# Altium project MSE-Interface-N1.PrjPcb (part 2 of 2)

## Sheet MicroSEQSheet.SchDoc
size A4; SheetNumber: 3; SheetTotal: 6
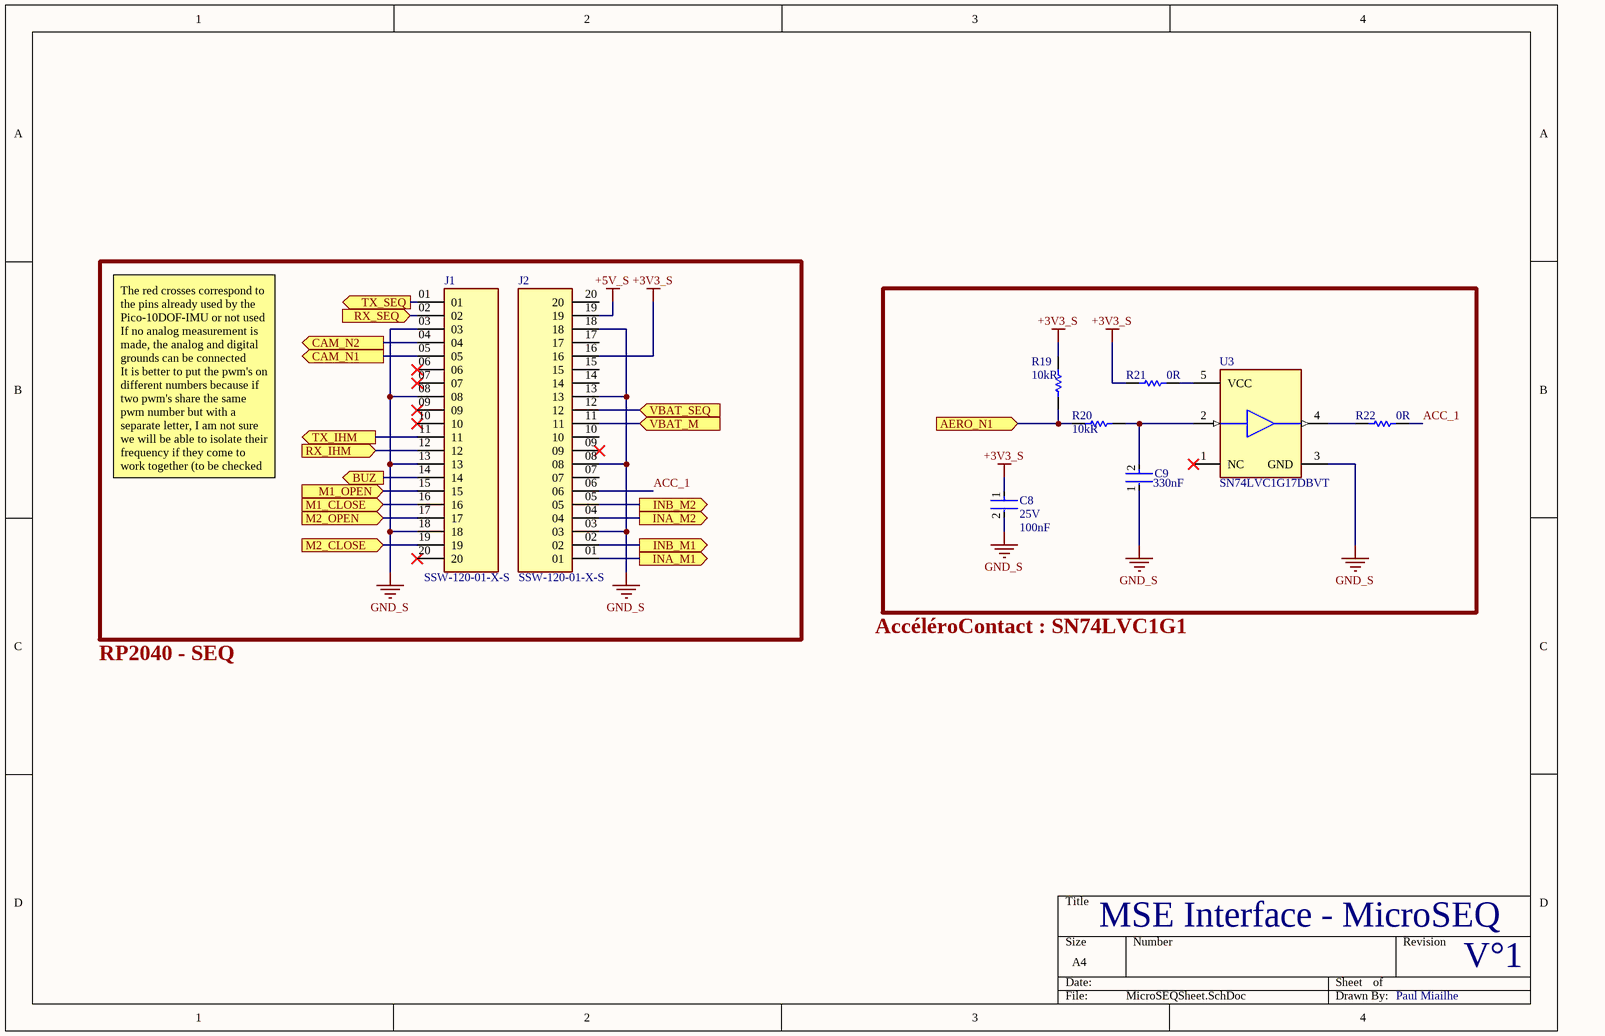
[diagram p4: MicroSEQSheet.SchDoc]

### Parts
C8  Voltage Rating (DC): 25V  Capacitance: 100nF  [FP-CGA3E-0_3-0_1-MFG]  (hidden comment: CGA3E2X7R1E104K080AA)
C9  Capacitance: 330nF  [FP-C1608-080-0_1-IPC_B]  (hidden comment: C1608X7R1H334K080AC)
J1  SSW-120-01-X-S  [SAMTEC_SSW-120-01-X-S]
J2  SSW-120-01-X-S  [SAMTEC_SSW-120-01-X-S]
R19  Resistance: 10kR  [RESC1609X55X30LL15T15]  (hidden comment: ERJ3EKF1002V)
R20  Resistance: 10kR  [RESC1609X55X30LL15T15]  (hidden comment: ERJ3EKF1002V)
R21  0R  [RESC1608X55X25ML10T15]
R22  0R  [RESC1608X55X25ML10T15]
U3  SN74LVC1G17DBVT  [FP-DBV0005A-MFG]

### Ports
AERO_N1 (in, see MainSheet[2B], GPIOSheet[4A]), BUZ (out, see MainSheet[2C], GPIOSheet[2B]), CAM_N1 (out, see MainSheet[2B], GPIOSheet[4A]), CAM_N2 (out, see MainSheet[2B], GPIOSheet[4A]), INA_M1 (out, see MainSheet[2C], GPIOSheet[2A]), INA_M2 (out, see MainSheet[2C], GPIOSheet[2B]), INB_M1 (out, see MainSheet[2C], GPIOSheet[2A]), INB_M2 (out, see MainSheet[2C], GPIOSheet[2B]), M1_CLOSE (in, see MainSheet[2C]), M1_OPEN (in, see MainSheet[2C]), M2_CLOSE (in, see MainSheet[2C]), M2_OPEN (in, see MainSheet[2C]), RX_IHM (in, see MainSheet[2B], GPIOSheet[4C]), RX_SEQ (in, see MainSheet[2C], IsolationSheet[3B]), TX_IHM (out, see MainSheet[2B], GPIOSheet[4C]), TX_SEQ (out, see MainSheet[2C], IsolationSheet[3B]), VBAT_M (in, see MainSheet[2B], PowerSheet[4B]), VBAT_SEQ (in, see MainSheet[2B], PowerSheet[2B])

### Nets
+3V3_S: C8.1 J2.16 R19.2 R21.1
+5V_S: J2.19
GND_S: C8.2 C9.1 J1.03 J1.08 J1.13 J1.18 J2.03 J2.08 J2.13 J2.18 U3.3(GND)
ACC_1: J2.06 R22.2
NetC1_2: J2.12 ; port VBAT_SEQ
NetC7_2: J2.11 ; port VBAT_M
NetC9_2: C9.2 R20.1 U3.2(A)
NetJ1_01: J1.01 ; port TX_SEQ
NetJ1_02: J1.02 ; port RX_SEQ
NetJ1_04: J1.04 ; port CAM_N2
NetJ1_05: J1.05 ; port CAM_N1
NetJ1_11: J1.11 ; port TX_IHM
NetJ1_12: J1.12 ; port RX_IHM
NetJ1_14: J1.14 ; port BUZ
NetJ1_15: J1.15 ; port M1_OPEN
NetJ1_16: J1.16 ; port M1_CLOSE
NetJ1_17: J1.17 ; port M2_OPEN
NetJ1_19: J1.19 ; port M2_CLOSE
NetJ2_01: J2.01 ; port INA_M1
NetJ2_02: J2.02 ; port INB_M1
NetJ2_04: J2.04 ; port INA_M2
NetJ2_05: J2.05 ; port INB_M2
NetR19_1: R19.1 R20.2 ; port AERO_N1
NetR21_2: R21.2 U3.5(VCC)
NetR22_1: R22.1 U3.4(Y)

Not connected (* = marked no-connect by the designer): J1 06* 07* 09* 10* 20*; J2 07 09* 10 14 15 17 20; U3 1(NC)*

### Notes on the sheet
- The red crosses correspond to the pins already used by the Pico-10DOF-IMU or not used
  If no analog measurement is made, the analog and digital grounds can be connected
  It is better to put the pwm's on different numbers because if two pwm's share the same pwm number but with a separate letter, I am not sure we will be able to isolate their frequency if they come to work together (to be checked by software)
- RP2040 - SEQ
- AccéléroContact : SN74LVC1G1
- MSE Interface - MicroSEQ
- V°1
- Paul Miailhe

### Library data of the parts
C8 = CMP-08246-002186-1: Cap Ceramic 100nF 25V X7R 10% Pad SMD 0603 +125°C Automotive T/R; Manufacturer: TDK; Composition: Ceramic; Dielectric: X7R; Ratings: AEC-Q200; Length: 1.6mm; REACH SVHC: No SVHC; Width: 0.031inch; Packaging: Tape and Reel; Case/Package: 0603; Height: 0.8mm; Termination: SMD/SMT; Max Operating Temperature: 125°C; Thickness: 0.035inch; Case Code (Metric): 1608; Lead Free: Lead Free; Mount: Surface Mount; Voltage Rating: 25V; Tolerance: 10%; Weight: 7.1E-05oz; Min Operating Temperature: -55°C; Package Quantity: 1; Depth: 0.8mm; Case Code (Imperial): 0603; Supplier 1: Mouser; Supplier Part Number 1: 810-CGA3E2X7R1E104K; Manufacturer Part Number: CGA3E2X7R1E104K080AA; RoHS: Yes; Category: Ceramic Capacitors; Stock 1: 488891; Pricing 1: 1=0,12000, 10=0,05600, 50=0,05600, 100=0,02500, 1000=0,01400, 10000=0,01000 (USD); Series: CGA; Resistor Type: Ceramic; RoHS Compliant: Yes; ComponentLink1URL: https://datasheet.ciiva.com/24220/cga3e2x7r1e104k080aa-265934-24220022.pdf?src-supplier=Mouser; ComponentLink1Description: https://datasheet.ciiva.com/24220/cga3e2x7r1e104k080aa-265934-24220022.pdf?src-supplier=Mouser; ComponentLink2URL: https://datasheet.ciiva.com/22725/1735392-22725638.pdf?src-supplier=Element14; ComponentLink2Description: https://datasheet.ciiva.com/22725/1735392-22725638.pdf?src-supplier=Element14; ComponentLink3URL: https://datasheet.ciiva.com/22725/1735392-22725639.pdf?src-supplier=Element14; ComponentLink3Description: https://datasheet.ciiva.com/22725/1735392-22725639.pdf?src-supplier=Element14; ComponentLink4URL: https://datasheet.ciiva.com/16427/mlccspec-automotive-general-midvoltage-en-16427320.pdf?src-supplier=Future+Electronics; ComponentLink4Description: https://datasheet.ciiva.com/16427/mlccspec-automotive-general-midvoltage-en-16427320.pdf?src-supplier=Future+Electronics; ComponentLink5URL: https://datasheet.ciiva.com/23803/1735392-23803082.pdf?src-supplier=Newark; ComponentLink5Description: https://datasheet.ciiva.com/23803/1735392-23803082.pdf?src-supplier=Newark
C9 = CMP-2000-07551-2: Multilayer Ceramic Capacitors 330nF ±10% 50V X7R SMD 0603; Case Code (Imperial): 0603; Case Code (Metric): 1608; Dielectric: X7R; Length: 1.6mm; Construction: Flat; Resistor Type: Ceramic; Mount: Surface Mount; Voltage Rating: 50V; Packaging: Tape and Reel; Series: C; Case/Package: 0603; Lead Free: Lead Free; Tolerance: 10%; Voltage: 50V; REACH SVHC: No SVHC; Height: 0.8mm; Weight: 7.1E-05oz; Termination: SMD/SMT; Max Operating Temperature: 125°C; RoHS Compliant: Yes; Min Operating Temperature: -55°C; Depth: 0.8mm; Package Quantity: 1; Thickness: 0.037inch; Voltage Rating (DC): 50V; Dielectric Material: Ceramic; Width: 0.031inch
J1 J2 = CMP-011-000000-2: SSW - Samtec 2.54mm Single Row Straight Socket Strip 8.5 Profile - Fast Stock; MP: SSW-120-01-G-S; Value: *; Check_prices: https://www.snapeda.com/parts/SSW-120-01-G-S/Samtec/view-part/598388/?ref=eda; Price: None; Design Item ID: SSW-120-01-X-S; SnapEDA_Link: https://www.snapeda.com/parts/SSW-120-01-G-S/Samtec/view-part/598388/?ref=snap; Component Type: Standard; MF: Samtec; Source: SSW-120-01-X-S.SchLib; Package: None; Pin Count: 20; Availability: Bad; Purchase-URL: https://pricing.snapeda.com/search/part/SSW-120-01-G-S/?ref=eda
R19 R20 = CMP-1012-00623-3: Chip Resistor, 10 KOhm, +/- 1%, 0.1 W, -55 to 155 degC, 0603 (1608 Metric), RoHS, Tape and Reel; Manufacturer: Panasonic; Manufacturer Part Number: ERJ-3EKF1002V; Voltage Rating: 75V; Case\/Package: 0603; Power Rating: 100mW; Temperature Coefficient: 100ppm\/degreesC; Number of Pins: 2; Package Reference: 603; Depth: 0.8mm; Mount: SurfaceMount; Package Description: 2-Pin Surface Mount Device, Body 1.6 x 0.85 mm; Datasheet Version: 02/2017; Length: 1.6mm; Lead Free: LeadFree; Height: 0.45mm; Number of Terminations: 2; Max Power Dissipation: 100mW; Min Operating Temperature: -55degC; Datasheet URL: https://industrial.panasonic.com/cdbs/www-data/pdf/RDA0000/AOA0000C304.pdf; Termination: SMD/SMT; Case Code (Metric): 1608; Tolerance: 1%; Max Operating Temperature: 155degC; RoHSCompliant: true; Voltage Rating (DC): 75V; Radiation Hardening: No; Packaging: TapeandReel; Composition: ThickFilm; Mounting Technology: SurfaceMount; Manufacturer URL: http://www.panasonic.com/; Width: 0.031inch; REACH SVHC: NoSVHC; Contact Plating: Tin; Military Standard: Not; Package Quantity: 1; Supplier 1: Mouser; Supplier Part Number 1: 667-ERJ-3EKF1002V; RoHS: Yes; Category: Chip SMD Resistors; Stock 1: 20455; Pricing 1: 1=0,10000, 10=0,04000, 50=0,04000, 100=0,01700, 1000=0,00700, 5000=0,00500, 10000=0,00500 (USD); Case/Package: 0603; Size Code: 0603; Resistor Type: Thick Film; Series: ERJ; Resistance Tolerance: 1%; Construction: Rectangular; Features: Automotive AEC-Q200; Technology: THICK FILM; RoHS Compliant: Yes; ComponentLink1URL: https://datasheet.ciiva.com/16511/aoa0000ce2-16511861.pdf?src-supplier=Avnet+Asia; ComponentLink1Description: https://datasheet.ciiva.com/16511/aoa0000ce2-16511861.pdf?src-supplier=Avnet+Asia; ComponentLink2URL: https://datasheet.ciiva.com/46372/1678782-46372725.pdf?src-supplier=Element14; ComponentLink2Description: https://datasheet.ciiva.com/46372/1678782-46372725.pdf?src-supplier=Element14; ComponentLink3URL: https://datasheet.ciiva.com/28514/426256-28514198.pdf?src-supplier=Element14; ComponentLink3Description: https://datasheet.ciiva.com/28514/426256-28514198.pdf?src-supplier=Element14; ComponentLink4URL: https://datasheet.ciiva.com/9194/aoa0000ce2-9194199.pdf?src-supplier=Avnet; ComponentLink4Description: https://datasheet.ciiva.com/9194/aoa0000ce2-9194199.pdf?src-supplier=Avnet; ComponentLink5URL: https://datasheet.ciiva.com/7830/aoa0000ce2-7830729.pdf?src-supplier=Element14; ComponentLink5Description: https://datasheet.ciiva.com/7830/aoa0000ce2-7830729.pdf?src-supplier=Element14; ComponentLink6URL: https://datasheet.ciiva.com/17212/aoa0000ce2-17212105.pdf?src-supplier=Avnet+Europe; ComponentLink6Description: https://datasheet.ciiva.com/17212/aoa0000ce2-17212105.pdf?src-supplier=Avnet+Europe; ComponentLink7URL: https://datasheet.ciiva.com/30208/aoa0000ce2-30208985.pdf?src-supplier=Onlinecomponents.com; ComponentLink7Description: https://datasheet.ciiva.com/30208/aoa0000ce2-30208985.pdf?src-supplier=Onlinecomponents.com; ComponentLink8URL: https://datasheet.ciiva.com/48530/aoa0000ce2-48530988.pdf?src-supplier=Avnet; ComponentLink8Description: https://datasheet.ciiva.com/48530/aoa0000ce2-48530988.pdf?src-supplier=Avnet; ComponentLink9URL: https://datasheet.ciiva.com/24070/aoa0000ce2-24070318.pdf?src-supplier=Mouser; ComponentLink9Description: https://datasheet.ciiva.com/24070/aoa0000ce2-24070318.pdf?src-supplier=Mouser; ComponentLink10URL: https://datasheet.ciiva.com/16759/70260748-16759807.pdf?src-supplier=Allied+Electronics; ComponentLink10Description: https://datasheet.ciiva.com/16759/70260748-16759807.pdf?src-supplier=Allied+Electronics
R21 R22 = CMP-2100-03667-1: Chip Resistor, 0 Ohm, +/- 5%, 0.1 W, -55 to 155 degC, 0603 (1608 Metric), RoHS, Tape and Reel; Manufacturer: Yageo; Temperature Coefficient: 200ppm/degreesC; Voltage Rating: 50V; Power Rating: 100mW; Resistance: 0mOhm; Width: 0.8mm; Max Operating Temperature: 155degC; Tolerance: 5%; Package Reference: 0603; Height: 0.45mm; Depth: 0.8mm; Package Description: 2-Pin Surface Mount Device, Body 1.6 x 0.8 mm; Termination: SMD/SMT; Package Quantity: 5000; Case/Package: 0603; Case Code (Imperial): 0603; Radiation Hardening: No; Number of Pins: 2; Length: 1.6mm; Lead Free: LeadFree; Voltage Rating (DC): 50V; Military Standard: Not; Datasheet URL: http://www.yageo.com/NewPortal/yageodocoutput?fileName=/pdf/R-Chip/PYu-RC_Group_51_RoHS_L_5.pdf; Manufacturer URL: http://www.yageo.com/; Packaging: TapeandReel; Case Code (Metric): 1608; Min Operating Temperature: -55degC; Composition: ThickFilm; RoHSCompliant: true; Contact Plating: Tin; Datasheet Version: Rev. 5, 10/2016; REACH SVHC: NoSVHC
U3 = CMP-0859-00041-5: IC BUF NON-INVERT 5.5V SOT23-5; Manufacturer: Texas Instruments; Number Of Circuits: 1; Logic Function Desc: Non-Inverting; Standoff Height: 0mm; Propagation Delay: 4.6ns; Min Supply Voltage: 1.65V; Nominal Supply Current: 10uA; Category: IC; Height: 1.45mm; Manufacturer Part Number: SN74LVC1G17DBVT; Temperature Range High: +125°C; Device Class L2: Logic ICs; Temperature: -40°C to +125°C; Temperature Range Low: -40°C; Device Class L3: Buffers; Package: DBV0005A; Max Supply Voltage: 5.5V; Ambient Temperature Range High: +125°C; Number Of Outputs: 1; Device Class L1: Integrated Circuits (ICs); ComponentLink2URL: http://www.ti.com/lit/ds/symlink/sn74lvc1g17.pdf; Octopart: https://octopart.com/sn74lvc1g17dbvt-texas+instruments-2326350; Number Of Inputs: 1; Ambient Temperature Range Low: -40°C; ComponentLink2Description: Datasheet; Digikey Description: IC BUF NON-INVERT 5.5V SOT23-5; Lead Free: Yes; Automotive: No; RoHS: TRUE; Mouser Description: Buffers & Line Drivers SNGL Schmitt Trigger Buffer

## Sheet IsolationSheet.SchDoc
size A4; SheetNumber: 6; SheetTotal: 6
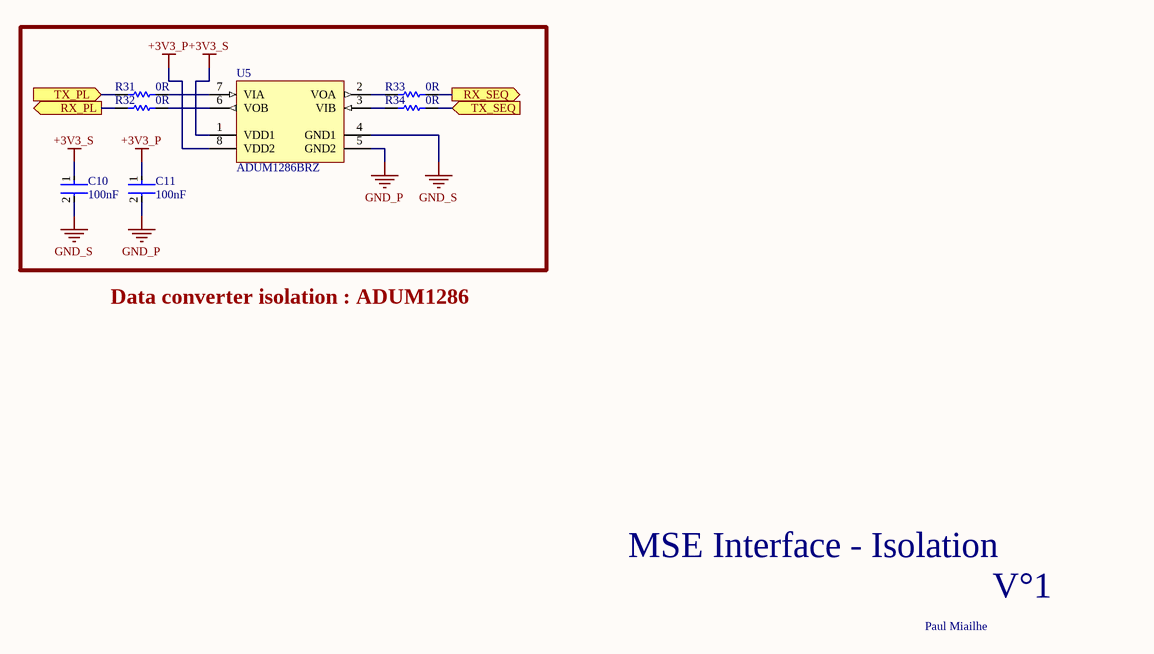
[diagram p5: IsolationSheet.SchDoc]

### Parts
C10  Capacitance: 100nF  [FP-CGA3E-0_3-0_1-MFG]  (hidden comment: CGA3E2X7R1E104K080AA)
C11  Capacitance: 100nF  [FP-CGA3E-0_3-0_1-MFG]  (hidden comment: CGA3E2X7R1E104K080AA)
R31  Resistance: 0R  [RESC1608X55X25ML10T15]  (hidden comment: RC0603JR-070RL)
R32  Resistance: 0R  [RESC1608X55X25ML10T15]  (hidden comment: RC0603JR-070RL)
R33  Resistance: 0R  [RESC1608X55X25ML10T15]  (hidden comment: RC0603JR-070RL)
R34  Resistance: 0R  [RESC1608X55X25ML10T15]  (hidden comment: RC0603JR-070RL)
U5  ADUM1286BRZ  [ADI-R-8_M]

### Ports
RX_PL (out, see MainSheet[3D], MicroPLSheet[2B]), RX_SEQ (out, see MainSheet[2D], MicroSEQSheet[1B]), TX_PL (in, see MainSheet[3D], MicroPLSheet[2B]), TX_SEQ (in, see MainSheet[2D], MicroSEQSheet[1B])

### Nets
+3V3_P: C11.1 U5.8(VDD2)
+3V3_S: C10.1 U5.1(VDD1)
GND_P: C11.2 U5.5(GND2)
GND_S: C10.2 U5.4(GND1)
NetJ1_01: R34.1 ; port TX_SEQ
NetJ1_02: R33.1 ; port RX_SEQ
NetJ3_01: R31.2 ; port TX_PL
NetJ3_02: R32.2 ; port RX_PL
NetR31_1: R31.1 U5.7(VIA)
NetR32_1: R32.1 U5.6(VOB)
NetR33_2: R33.2 U5.2(VOA)
NetR34_2: R34.2 U5.3(VIB)

### Notes on the sheet
- Data converter isolation : ADUM1286
- MSE Interface - Isolation
- V°1
- Paul Miailhe

### Library data of the parts
C10 C11 = CMP-08246-002186-1: as C8 on sheet MicroSEQSheet; Composition: Ceramic; Dielectric: X7R; Ratings: AEC-Q200; Length: 1.6mm; REACH SVHC: No SVHC; Width: 0.031inch; Packaging: Tape and Reel; Case/Package: 0603; Height: 0.8mm; Termination: SMD/SMT; Max Operating Temperature: 125°C; Thickness: 0.035inch; Case Code (Metric): 1608; Lead Free: Lead Free; Mount: Surface Mount; Voltage Rating: 25V; Tolerance: 10%; Weight: 7.1E-05oz; Min Operating Temperature: -55°C; Package Quantity: 1; Depth: 0.8mm; Case Code (Imperial): 0603; Supplier 1: Mouser; Supplier Part Number 1: 810-CGA3E2X7R1E104K; Manufacturer Part Number: CGA3E2X7R1E104K080AA; RoHS: Yes; Category: Ceramic Capacitors; Stock 1: 488891; Pricing 1: 1=0,12000, 10=0,05600, 50=0,05600, 100=0,02500, 1000=0,01400, 10000=0,01000 (USD); Series: CGA; Resistor Type: Ceramic; RoHS Compliant: Yes; ComponentLink1URL: https://datasheet.ciiva.com/24220/cga3e2x7r1e104k080aa-265934-24220022.pdf?src-supplier=Mouser; ComponentLink1Description: https://datasheet.ciiva.com/24220/cga3e2x7r1e104k080aa-265934-24220022.pdf?src-supplier=Mouser; ComponentLink2URL: https://datasheet.ciiva.com/22725/1735392-22725638.pdf?src-supplier=Element14; ComponentLink2Description: https://datasheet.ciiva.com/22725/1735392-22725638.pdf?src-supplier=Element14; ComponentLink3URL: https://datasheet.ciiva.com/22725/1735392-22725639.pdf?src-supplier=Element14; ComponentLink3Description: https://datasheet.ciiva.com/22725/1735392-22725639.pdf?src-supplier=Element14; ComponentLink4URL: https://datasheet.ciiva.com/16427/mlccspec-automotive-general-midvoltage-en-16427320.pdf?src-supplier=Future+Electronics; ComponentLink4Description: https://datasheet.ciiva.com/16427/mlccspec-automotive-general-midvoltage-en-16427320.pdf?src-supplier=Future+Electronics; ComponentLink5URL: https://datasheet.ciiva.com/23803/1735392-23803082.pdf?src-supplier=Newark; ComponentLink5Description: https://datasheet.ciiva.com/23803/1735392-23803082.pdf?src-supplier=Newark
R31-R34 = CMP-2100-03667-1: as R1 on sheet PowerSheet; Width: 0.8mm; Max Operating Temperature: 155degC; Tolerance: 5%; Height: 0.45mm; Depth: 0.8mm; Package Description: 2-Pin Surface Mount Device, Body 1.6 x 0.8 mm; Termination: SMD/SMT; Package Quantity: 5000; Case/Package: 0603; Radiation Hardening: No; Number of Pins: 2; Length: 1.6mm; Lead Free: LeadFree; Voltage Rating (DC): 50V; Military Standard: Not; Datasheet URL: http://www.yageo.com/NewPortal/yageodocoutput?fileName=/pdf/R-Chip/PYu-RC_Group_51_RoHS_L_5.pdf; Manufacturer URL: http://www.yageo.com/; Packaging: TapeandReel; Case Code (Metric): 1608; Min Operating Temperature: -55degC; Composition: ThickFilm; RoHSCompliant: true; Contact Plating: Tin; Datasheet Version: Rev. 5, 10/2016; REACH SVHC: NoSVHC; Supplier 1: Mouser; Supplier Part Number 1: 603-RC0603JR-070RL; Manufacturer Part Number: RC0603JR-070RL; RoHS: Yes; Category: Chip SMD Resistors; Stock 1: 968392; Pricing 1: 1=0,10000, 10=0,01000, 50=0,01000, 100=0,00500, 1000=0,00400, 5000=0,00200, 10000=0,00200 (USD); Size Code: 0603; Resistor Type: Thick Film; Features: Moisture Resistant; Series: RC; Max Power Dissipation: 100mW; Number of Terminations: 2; Construction: Rectangular; Technology: THICK FILM; Resistance Tolerance: 5%; RoHS Compliant: Yes; ComponentLink1URL: https://datasheet.ciiva.com/11808/pyu-r-int-6-11808700.pdf?src-supplier=RSComponents; ComponentLink1Description: https://datasheet.ciiva.com/11808/pyu-r-int-6-11808700.pdf?src-supplier=RSComponents; ComponentLink2URL: https://datasheet.ciiva.com/22747/443971-22747530.pdf?src-supplier=Element14; ComponentLink2Description: https://datasheet.ciiva.com/22747/443971-22747530.pdf?src-supplier=Element14; ComponentLink3URL: https://datasheet.ciiva.com/12555/rc0603-272842-12555254.pdf?src-supplier=Mouser; ComponentLink3Description: https://datasheet.ciiva.com/12555/rc0603-272842-12555254.pdf?src-supplier=Mouser; ComponentLink4URL: https://datasheet.ciiva.com/7746/1738695-7746421.pdf?src-supplier=Element14; ComponentLink4Description: https://datasheet.ciiva.com/7746/1738695-7746421.pdf?src-supplier=Element14; ComponentLink5URL: https://datasheet.ciiva.com/7746/1738695-7746422.pdf?src-supplier=Element14; ComponentLink5Description: https://datasheet.ciiva.com/7746/1738695-7746422.pdf?src-supplier=Element14; ComponentLink6URL: https://datasheet.ciiva.com/8883/pyu-rc0603-51-rohs-l-4-8883045.pdf?src-supplier=Avnet; ComponentLink6Description: https://datasheet.ciiva.com/8883/pyu-rc0603-51-rohs-l-4-8883045.pdf?src-supplier=Avnet; ComponentLink7URL: https://datasheet.ciiva.com/15189/getdatasheetpartid-329462-15189845.pdf?src-supplier=Verical; ComponentLink7Description: https://datasheet.ciiva.com/15189/getdatasheetpartid-329462-15189845.pdf?src-supplier=Verical
U5 = CMP-0534-00129-1: Dual Channel Default High Digital Isolator, 3 KV rms Insulation Rating, 25 Mbps Data Rate, 35 ns Delay, Industrial, 8-pin SOIC (R-8), Tube; Manufacturer: Analog Devices; Insulation Rating (kVrms): 3; Max Data Rate: 25Mbps; ComponentLink1URL: http://www.analog.com/en/index.html; PackageVersion: 060506-A, 06/2006; Mounting Technology: Surface Mount; PackageDescription: 8-Pin Standard Small Outline Package, Body 4.9 x 3.9 mm, Pitch 1.27 mm; ComponentLink1Description: Manufacturer URL; ComponentLink3URL: http://www.analog.com/static/imported-files/packages/PKG_PDF/SOIC_Narrow%20(R)/R_8.pdf; ComponentLink2Description: Datasheet; Max Operating Temp (degreesC): 125; ComponentLink4URL: Product URL:http://www.analog.com/en/interface-isolation/digital-isolators/adum1286/products/product.html; PackageReference: R-8; DatasheetVersion: Rev. 0; ComponentLink2URL: http://www.analog.com/static/imported-files/data_sheets/ADuM1280_1281_1285_1286.pdf; PartNumber: ADUM1286BRZ; ComponentLink3Description: Package Specification; Code_JEDEC: MS-012-AA; ComponentLink4Description: URL Link1

## Nets that join several sheets
+3V3_P: MicroPLSheet (J4.16 LED1.1 R26.2 R27.2), GPIOSheet (J11.1 J12.2 P1.20), IsolationSheet (C11.1 U5.8)
+3V3_S: GPIOSheet (J13.1 P2.12), MicroSEQSheet (C8.1 J2.16 R19.2 R21.1), IsolationSheet (C10.1 U5.1)
+5V_P: MicroPLSheet (J4.19), GPIOSheet (J11.2), PowerSheet (C6.2 U2.3)
+5V_S: GPIOSheet (J13.2), PowerSheet (C4.2 U1.3), MicroSEQSheet (J2.19)
+9V_M: GPIOSheet (P2.20), PowerSheet (Q3.2 R12.1 R13.2)
+9V_S: GPIOSheet (P2.13), PowerSheet (5 pins)
GND_P: MicroPLSheet (8 pins), GPIOSheet (11 pins), PowerSheet (7 pins), IsolationSheet (C11.2 U5.5)
GND_S: GPIOSheet (12 pins), PowerSheet (11 pins), MicroSEQSheet (11 pins), IsolationSheet (C10.2 U5.4)
NetC1_2: PowerSheet (C1.2 R3.1 R4.2), MicroSEQSheet (J2.12)
NetC3_2: MicroPLSheet (J4.14), PowerSheet (C3.2 R8.1 R9.2)
NetC7_2: PowerSheet (C7.2 R13.1 R14.2), MicroSEQSheet (J2.11)
NetF1_1: GPIOSheet (J9.1), PowerSheet (F1.1)
NetF2_1: GPIOSheet (J10.1), PowerSheet (F2.1)
NetF3_1: GPIOSheet (J9.3), PowerSheet (F3.1)
NetJ1_01: MicroSEQSheet (J1.01), IsolationSheet (R34.1)
NetJ1_02: MicroSEQSheet (J1.02), IsolationSheet (R33.1)
NetJ1_04: GPIOSheet (R30.2), MicroSEQSheet (J1.04)
NetJ1_05: GPIOSheet (R29.2), MicroSEQSheet (J1.05)
NetJ1_11: GPIOSheet (R36.2), MicroSEQSheet (J1.11)
NetJ1_12: GPIOSheet (R35.2), MicroSEQSheet (J1.12)
NetJ1_14: GPIOSheet (P2.2), MicroSEQSheet (J1.14)
NetJ1_15: GPIOSheet (P2.4), MicroSEQSheet (J1.15)
NetJ1_16: GPIOSheet (P2.6), MicroSEQSheet (J1.16)
NetJ1_17: GPIOSheet (P2.8), MicroSEQSheet (J1.17)
NetJ1_19: GPIOSheet (P2.10), MicroSEQSheet (J1.19)
NetJ2_01: GPIOSheet (P2.19), MicroSEQSheet (J2.01)
NetJ2_02: GPIOSheet (P2.18), MicroSEQSheet (J2.02)
NetJ2_04: GPIOSheet (P2.16), MicroSEQSheet (J2.04)
NetJ2_05: GPIOSheet (P2.15), MicroSEQSheet (J2.05)
NetJ3_01: MicroPLSheet (J3.01), IsolationSheet (R31.2)
NetJ3_02: MicroPLSheet (J3.02), IsolationSheet (R32.2)
NetJ3_04: MicroPLSheet (J3.04), GPIOSheet (P1.18)
NetJ3_05: MicroPLSheet (J3.05), GPIOSheet (P1.17)
NetJ3_11: MicroPLSheet (J3.11), GPIOSheet (P1.6)
NetJ3_12: MicroPLSheet (J3.12), GPIOSheet (P1.7)
NetJ3_14: MicroPLSheet (J3.14), GPIOSheet (P1.14)
NetJ3_15: MicroPLSheet (J3.15), GPIOSheet (P1.15)
NetJ3_16: MicroPLSheet (J3.16), GPIOSheet (P1.16)
NetJ3_17: MicroPLSheet (J3.17), GPIOSheet (P1.13)
NetJ3_19: MicroPLSheet (J3.19), GPIOSheet (P1.12)
NetJ4_01: MicroPLSheet (J4.01 R17.1), GPIOSheet (R37.1)
NetJ4_02: MicroPLSheet (J4.02 R16.1), GPIOSheet (R41.1)
NetJ4_04: MicroPLSheet (J4.04 R15.1), GPIOSheet (R38.1)
NetJ4_05: MicroPLSheet (J4.05), GPIOSheet (P1.4)
NetJ4_11: MicroPLSheet (J4.11), GPIOSheet (P1.5)
NetJ4_12: MicroPLSheet (J4.12), GPIOSheet (P1.10)
NetR19_1: GPIOSheet (R28.2), MicroSEQSheet (R19.1 R20.2)
SCL: MicroPLSheet (J4.07 R26.1), GPIOSheet (R40.2 R42.2)
SDA: MicroPLSheet (J4.06 R27.1), GPIOSheet (R39.2 R43.2)